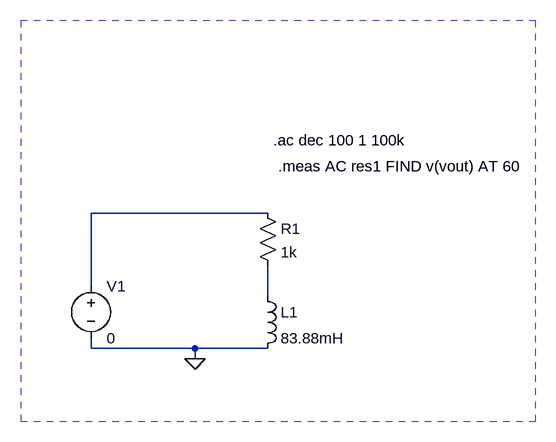
[diagram p0: schematic HW2.2.asc]
HW2.2.asc, the LTspice schematic file:
Version 4
SHEET 1 1012 680
WIRE 512 192 240 192
WIRE 240 304 240 192
WIRE 512 320 512 272
WIRE 240 400 240 384
WIRE 400 400 240 400
WIRE 512 400 400 400
WIRE 400 416 400 400
FLAG 400 416 0
SYMBOL Res 496 176 R0
SYMATTR InstName R1
SYMATTR Value 1k
SYMBOL ind 496 304 R0
SYMATTR InstName L1
SYMATTR Value 83.88mH
SYMBOL voltage 240 288 R0
SYMATTR InstName V1
SYMATTR Value 0
SYMATTR Value2 AC 1
TEXT 520 80 Left 2 !.ac dec 100 1 100k
TEXT 528 120 Left 2 !.meas AC res1 FIND v(vout) AT 60
RECTANGLE Normal 132 512 924 -104 2

The netlist it stands for:
* HW2.2.asc
R1 N001 N002 1k
L1 N002 0 83.88mH
V1 N001 0 0 AC 1
.ac dec 100 1 100k
.meas AC res1 FIND v(vout) AT 60
.backanno
.end